# EAGLE design expansion_module_dual_rotary_encoder (EAGLE 9.6.2)
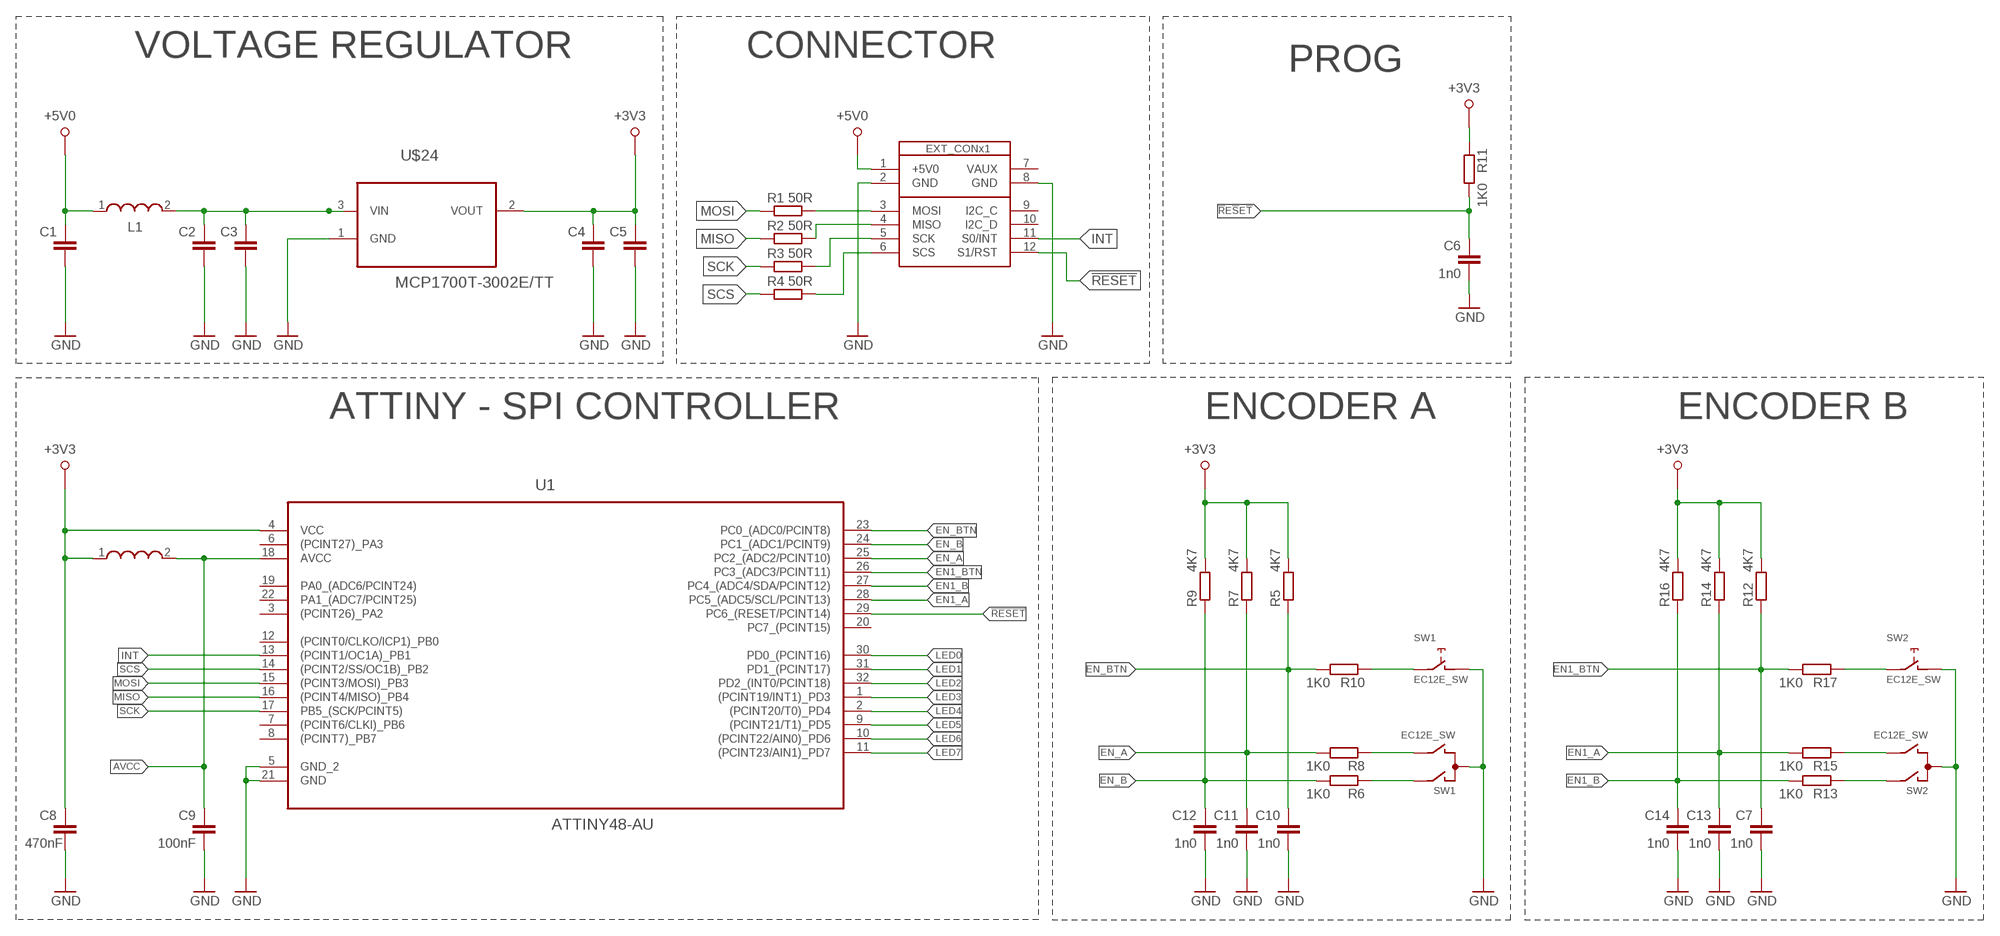
[diagram p0: schematic, sheet 1]

## Parts
C1  C-EUC0805  [C0805]
C2  C-EUC0805  [C0805]
C3  C-EUC0805  [C0805]
C4  C-EUC0805  [C0805]
C5  C-EUC0805  [C0805]
C6  1n0  C-EUC0805  [C0805]
C7  1n0  C-EUC0805  [C0805]
C8  470nF  C-EUC0805  [C0805]
C9  100nF  C-EUC0805  [C0805]
C10  1n0  C-EUC0805  [C0805]
C11  1n0  C-EUC0805  [C0805]
C12  1n0  C-EUC0805  [C0805]
C13  1n0  C-EUC0805  [C0805]
C14  1n0  C-EUC0805  [C0805]
L1  WE-LQ_1210  [WE-LQ_M]
L2  WE-PMI_0805  [WE-PMI_0805]
R1  50R  R-EU_R0805  [R0805]
R2  50R  R-EU_R0805  [R0805]
R3  50R  R-EU_R0805  [R0805]
R4  50R  R-EU_R0805  [R0805]
R5  4K7  R-EU_R0805  [R0805]
R6  1K0  R-EU_R0805  [R0805]
R7  4K7  R-EU_R0805  [R0805]
R8  1K0  R-EU_R0805  [R0805]
R9  4K7  R-EU_R0805  [R0805]
R10  1K0  R-EU_R0805  [R0805]
R11  1K0  R-EU_R0805  [R0805]
R12  4K7  R-EU_R0805  [R0805]
R13  1K0  R-EU_R0805  [R0805]
R14  4K7  R-EU_R0805  [R0805]
R15  1K0  R-EU_R0805  [R0805]
R16  4K7  R-EU_R0805  [R0805]
R17  1K0  R-EU_R0805  [R0805]
SW1  EC12E_SW  [ALPS_EC12E_SW]
SW2  EC12E_SW  [ALPS_EC12E_SW]
U1  ATTINY48-AU  [QFP80P900X900X120-32N]
U$1  SB_EXT_CON_X1_SPI  [SB_EXT_CON_X1_FULL]
U$24  MCP1700T-3002E/TT  [SOT95P237X112-3N]

## Nets
!R!E!S!E!T: C6.2 R11.2
!RESET: U1.29(PC6_(RESET/PCINT14)) U$1.12(S1/RST)
+3V3: C4.2 C5.2 C8.2 L2.1 R5.2 R7.2 R9.2 R11.1 R12.2 R14.2 R16.2 U1.4(VCC) U$24.2(VOUT)
+5V0: C1.2 L1.1 U$1.1(+5V0)
AVCC: C9.2 L2.2 U1.18(AVCC)
EN1_A: C13.2 R14.1 R15.2 U1.28(PC5_(ADC5/SCL/PCINT13))
EN1_B: C14.2 R13.2 R16.1 U1.27(PC4_(ADC4/SDA/PCINT12))
EN1_BTN: C7.2 R12.1 R17.2 U1.26(PC3_(ADC3/PCINT11))
EN_A: C11.2 R7.1 R8.2 U1.25(PC2_(ADC2/PCINT10))
EN_B: C12.2 R6.2 R9.1 U1.24(PC1_(ADC1/PCINT9))
EN_BTN: C10.2 R5.1 R10.2 U1.23(PC0_(ADC0/PCINT8))
GND: C1.1 C2.1 C3.1 C4.1 C5.1 C6.1 C7.1 C8.1 C9.1 C10.1 C11.1 C12.1 C13.1 C14.1 SW1.C SW1.D SW2.C SW2.D U1.5(GND_2) U1.21(GND) U$1.2(GND) U$1.8(GND) U$24.1(GND)
INT: U1.13((PCINT1/OC1A)_PB1) U$1.11(S0/INT)
LED0: U1.30(PD0_(PCINT16))
LED1: U1.31(PD1_(PCINT17))
LED2: U1.32(PD2_(INT0/PCINT18))
LED3: U1.1((PCINT19/INT1)_PD3)
LED4: U1.2((PCINT20/T0)_PD4)
LED5: U1.9((PCINT21/T1)_PD5)
LED6: U1.10((PCINT22/AIN0)_PD6)
LED7: U1.11((PCINT23/AIN1)_PD7)
MISO: R2.1 U1.16((PCINT4/MISO)_PB4)
MOSI: R1.1 U1.15((PCINT3/MOSI)_PB3)
N$1: R1.2 U$1.3(MOSI)
N$2: R2.2 U$1.4(MISO)
N$3: R3.2 U$1.5(SCK)
N$4: R4.2 U$1.6(SCS)
N$5: R6.1 SW1.A
N$7: R13.1 SW2.A
N$8: C2.2 C3.2 L1.2 U$24.3(VIN)
N$9: R15.1 SW2.B
N$11: R8.1 SW1.B
N$12: R10.1 SW1.E
N$13: R17.1 SW2.E
SCK: R3.1 U1.17(PB5_(SCK/PCINT5))
SCS: R4.1 U1.14((PCINT2/SS/OC1B)_PB2)
Unconnected: SW1.GND1(G) SW1.GND2(G) SW2.GND1(G) SW2.GND2(G) U1.3((PCINT26)_PA2) U1.6((PCINT27)_PA3) U1.7((PCINT6/CLKI)_PB6) U1.8((PCINT7)_PB7) U1.12((PCINT0/CLKO/ICP1)_PB0) U1.19(PA0_(ADC6/PCINT24)) U1.20(PC7_(PCINT15)) U1.22(PA1_(ADC7/PCINT25)) U$1.7(VAUX) U$1.9(I2C_C) U$1.10(I2C_D)

## Notes on the sheet
- VOLTAGE REGULATOR | CONNECTOR
- PROG
- ATTINY - SPI CONTROLLER | ENCODER A | ENCODER B

## Library data of the parts
C1-C14 = resistor:C-EU: CAPACITOR, European symbol
L1 = EagleLibrary_Wuerth_Elektronik_eiSos_rev16a:WE-LQ: SMD Inductor Characteristics Miniature chip inductor wound on a special ferrite core Small inductances for compact circuits High Q at high frequencies Low DC-resistance Operating temperature: –40 ºC to +125 ºC Applications Low power DC/DC-converters from Linear Technology, National Semiconductor, Texas Instruments, Fairchild Semiconductor, ON Semiconductor, STMicroelectronics, Maxim, MPS, Semtech, Exar, Analogic Tech, Diodes and Cologne Chip EMI-Filtering RF-circuits <http://katalog.we-online.de/media/images/eisos/IndLQ_pf2.jpg> Details see: http://katalog.we-online.de/en/pbs/WE-LQ? Updated by Dan Xu 2014-07-08 2014 (C) Wurth Elektronik
L2 = EagleLibrary_Wuerth_Elektronik_eiSos_rev16a:WE-PMI: Power Multilayer Inductor Characteristics Compact multilayer type Suitable for applications with high currents up to 2.7 A Smallest RDC-Values starting at 40 mΩ Magnetically shielded construction: No crosstalk Operating temperature: –40 °C to +125 °C Available in four sizes and three different types (Low Profile, Low RDC & High Saturation Current) Recommended soldering profile: Reflow Applications DC/DC converters especially at high switching frequencies > 1 MHz Electronic devices with very low profile Portable devices like Smart Phones, Tablets, Notebooks and Digital Cameras <http://katalog.we-online.de/media/images/eisos/IndPMI_pf2.jpgg> Details see: http://katalog.we-online.de/en/pbs/WE-PMI? Updated by Dan Xu 2014-07-08 2014 (C) Wurth Elektronik
R1-R17 = resistor:R-EU_: RESISTOR, European symbol
SW1 SW2 = alps-EC12E2424407:EC12E_SW: ALPS rotary Encoder EC12E series with switch; MPN: EC12E2424407; OC_FARNELL: 1520813; OC_NEWARK: 74M1068
U1 = Atmel_By_element14_Batch_1-00:ATTINY48-AU: 8-bit Microcontroller; MPN: ATTINY48-AU; OC_FARNELL: 1636953; OC_NEWARK: 68T3768; PACKAGE: QFP-32; SUPPLIER: Atmel
U$1 = al_smartboard:SB_EXT_CON_X1_SPI
U$24 = Microchip_By_element14_Batch_1:MCP1700T-3002E/TT: Low Quiescent Current LDO; MPN: MCP1700T-3002E/TT; OC_FARNELL: 1331482; OC_NEWARK: 84R5176; PACKAGE: SOT23-3; SUPPLIER: Microchip

## Net classes
0 default: clearance 0.205 mm

## Board
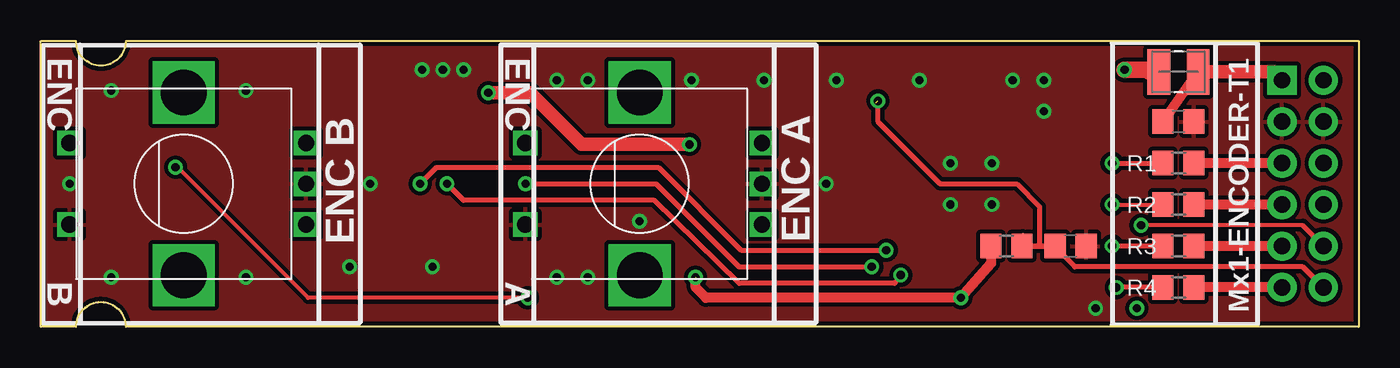
[diagram p1: board, top side]
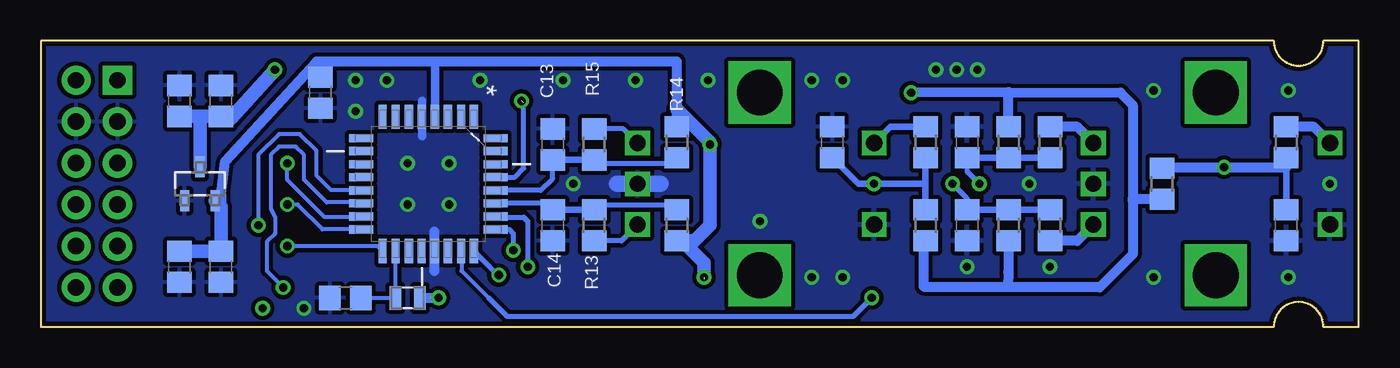
[diagram p2: board, bottom side, seen from below]

Size 80.77 x 17.53 mm. Coordinates in mm from the lower left corner, seen from the top.
Copper layers (1*16): Top 0.035mm / dielectric 1.5mm / Bottom 0.035mm
Design rules "smartboard *": minimum track width 10mil, minimum drill 15mil, track to track 8mil, track to pad 8mil, pad to pad 8mil, via to via 8mil, smd to smd 8mil, copper to edge 10mil, drill to drill 10mil, minimum pad ring 10mil, minimum via ring 8mil, stop-mask expansion 4mil, vias tented up to drill 20mil, thermal gap 10mil

### Footprints (pad centres in the part's own frame; a part is rotated, then mirrored left to right if it is on the bottom)
C0805 = smd 1.3 x 1.5: 1 -0.95,0; 2 0.95,0
WE-LQ_M = smd 1.4 x 2.8: 1 -1.2,0; 2 1.2,0
WE-PMI_0805 = smd 0.7 x 1.45: 1 -0.75,0; 2 0.75,0
R0805 = smd 1.3 x 1.5: 1 -0.95,0; 2 0.95,0
ALPS_EC12E_SW = drill 1 square: A -2.5,-7.5; B 2.5,-7.5; C 0,-7.5; D -2.5,7; E 2.5,7 | drill 2.8 square: GND1 -5.6,0; GND2 5.6,0
QFP80P900X900X120-32N = smd 1.473 x 0.508: 1 -4.115,2.794; 2 -4.115,2.007; 3 -4.115,1.194; 4 -4.115,0.406; 5 -4.115,-0.406; 6 -4.115,-1.194; 7 -4.115,-2.007; 8 -4.115,-2.794; 17 4.115,-2.794; 18 4.115,-2.007; 19 4.115,-1.194; 20 4.115,-0.406; 21 4.115,0.406; 22 4.115,1.194; 23 4.115,2.007; 24 4.115,2.794 | smd 0.508 x 1.473: 9 -2.794,-4.115; 10 -2.007,-4.115; 11 -1.194,-4.115; 12 -0.406,-4.115; 13 0.406,-4.115; 14 1.194,-4.115; 15 2.007,-4.115; 16 2.794,-4.115; 25 2.794,4.115; 26 2.007,4.115; 27 1.194,4.115; 28 0.406,4.115; 29 -0.406,4.115; 30 -1.194,4.115; 31 -2.007,4.115; 32 -2.794,4.115
SB_EXT_CON_X1_FULL = drill 1 pad 1.778 square: 1 15.24,5.08 | drill 1 pad 1.778: 2 12.7,5.08; 3 10.16,5.08; 4 7.62,5.08; 5 5.08,5.08; 6 2.54,5.08; 7 15.24,2.54; 8 12.7,2.54; 9 10.16,2.54; 10 7.62,2.54; 11 5.08,2.54; 12 2.54,2.54
SOT95P237X112-3N = smd 0.559 x 1.27: 1 -0.94,-1.041; 2 0.94,-1.041; 3 0,1.041

### Placement (x,y rotation side)
C1  69.72,12.57 180 top
C2  72.26,13.84 270 bottom
C3  69.72,13.84 270 bottom
C4  69.72,3.68 90 bottom
C5  72.26,3.68 90 bottom
C6  63.12,4.95 180 top
C7  32.26,11.3 270 bottom
C8  63.63,14.35 90 bottom
C9  62.1,1.78 0 bottom
C10  4.45,6.22 90 bottom
C11  24,11.3 270 bottom
C12  24,6.22 90 bottom
C13  49.4,11.18 270 bottom
C14  49.4,6.22 90 bottom
L1  69.72,15.62 180 top
L2  58.29,1.78 180 bottom
R1  69.72,10.03 0 top
R2  69.72,7.49 0 top
R3  69.72,4.95 0 top
R4  69.72,2.41 0 top
R5  12.07,8.76 270 bottom
R6  18.92,6.22 90 bottom
R7  21.46,11.3 90 bottom
R8  18.92,11.3 270 bottom
R9  21.46,6.22 270 bottom
R10  4.45,11.3 270 bottom
R11  59.18,4.95 0 top
R12  26.54,6.22 270 bottom
R13  46.86,6.22 90 bottom
R14  41.78,11.3 90 bottom
R15  46.86,11.18 270 bottom
R16  41.78,6.22 270 bottom
R17  26.54,11.3 270 bottom
SW1  8.76,8.76 90 top
SW2  36.7,8.76 90 top
U1  57.02,8.76 270 bottom
U$1  81.15,-0.13 90 top
U$24  71.02,8.76 0 bottom

### Tracks (layer width: path | path; a pad name or v marks a point on that pad's centre or on a via)
!R!E!S!E!T
  Top 0.305: R11.2 C6.2
!RESET  (via drill 0.5)  (1 unrouted)
  Top 0.305: U$1.12 77.34,3.68 63.37,3.68 62.1,4.95 61.09,4.95 | 61.09,4.95 60.2,4.95 60.2,5.59 | 61.09,4.95 61.21,5.08 61.21,7.37 59.82,8.76 55.12,8.76 51.31,12.57 v51.31,13.84
  Bottom 0.305: U1.29 51.71,9.17 51.18,9.7 51.18,13.72
+3V3  (via drill 0.5)  (1 unrouted)
  Top 0.61: 40.13,2.92 40.13,2.41 40.77,1.78 v56.39,1.78 58.23,3.88 R11.1
  Top 0.813: v27.43,14.35 29.97,14.35 33.15,11.18 v39.75,11.18
  Bottom 0.406: R9.2 21.46,3.43
  Bottom 0.508: U1.4 56.62,16.15
  Bottom 0.61: R9.2 21.48,3.37 21.49,2.46 | 21.49,2.46 21.49,2.44 15.88,2.41 13.84,4.44 13.84,7.75 13.78,7.81 | R5.2 13.78,7.81 | 21.46,14.38 14.61,14.35 13.84,13.59 13.84,7.88 13.78,7.81 | R7.2 21.46,14.38 | 21.46,14.38 v27.43,14.35 | L2.1 v56.39,1.78 56.26,1.78 | 56.64,16.26 41.78,16.26 41.78,13.33 R14.2 | 56.64,16.26 63.88,16.26 | 56.62,16.15 56.64,16.26 | U$24.2 70.08,7.77 69.72,8.13 | 69.72,8.13 69.47,10.16 63.88,16.26 | 69.72,8.13 69.72,6.86 | R12.2 26.67,5.15 26.67,2.54 26.67,2.46 21.49,2.46 | R16.2 41.53,5.33 | C8.2 63.88,16.26
  Bottom 0.813: U$24.2 69.72,7.37 69.72,6.86 C4.2 C5.2 | R16.2 40.7,5.27 39.75,6.22 v39.75,11.18 39.75,11.3 41.78,13.33 | 41.53,5.33 40.13,3.94 v40.13,3.05
+5V0
  Top 0.61: L1.1 C1.2
  Top 0.813: U$1.1 75.56,15.62 L1.1
AVCC
  Bottom 0.254: C9.2 L2.2 59.03,1.79 U1.18
EN1_A
  Bottom 0.305: U1.28 50.13,8.36 49.4,9.08 C13.2 | R15.2 46.86,10.03 41.78,10.03 R14.1
  Bottom 0.406: R15.2 C13.2
EN1_B
  Bottom 0.305: C14.2 49.8,7.57 U1.27 | R13.2 46.35,7.17 46.35,7.49 41.78,7.49 R16.1
  Bottom 0.406: R13.2 C14.2
EN1_BTN  (via drill 0.5)
  Top 0.305: v29.72,8.76 37.72,8.76 42.8,3.68 v50.93,3.68
  Bottom 0.305: U1.26 52.88,6.73 51.18,6.73 50.93,6.48 v50.93,3.68
  Bottom 0.406: R17.2 26.54,8.76 | 26.54,8.76 R12.1 | C7.2 30.67,8.76 v29.72,8.76 26.54,8.76
EN_A  (via drill 0.5)
  Top 0.305: v23.24,8.76 24.26,9.78 37.85,9.78 42.93,4.7 v51.82,4.7
  Bottom 0.305: U1.25 52.07,5.97 51.82,5.71 v51.82,4.7 | C11.2 24,9.53 v23.24,8.76
  Bottom 0.406: R8.2 R7.1 C11.2
EN_B  (via drill 0.5)
  Top 0.305: v52.7,3.17 52.32,2.67 42.8,2.67 37.59,7.75 25.91,7.75 v24.89,8.76
  Bottom 0.305: U1.24 53.26,3.68 v52.7,3.17 | C12.2 24,7.87 v24.89,8.76
  Bottom 0.406: R6.2 R9.1 C12.2
EN_BTN  (via drill 0.5)
  Top 0.254: v29.84,1.78 16.38,1.78 8.38,9.78 v8.25,9.78
  Bottom 0.254: U1.23 54.99,4.62 54.99,3.43 53.31,1.78
  Bottom 0.305: v29.84,1.78 30.99,0.64 52.17,0.64 53.31,1.78
  Bottom 0.406: C10.2 4.45,9.78 R10.2
  Bottom 0.61: R5.1 12,9.78 v8.25,9.78 4.45,9.78
GND  (via drill 0.5)
  Bottom 0.508: 57.4,11.68 57.4,13.84
  Bottom 0.61: 56.64,3.43 56.64,5.84
  Bottom 1.016: 42.8,8.76 45.47,8.76
  other vias: 58.29,10.03 55.75,10.03 58.29,7.49 55.75,7.49 20.19,8.76 18.92,3.68 24,3.68 44.32,15.11 48.77,15.11 53.85,15.11 59.56,15.11 61.47,15.11 36.7,6.48 23.37,15.75 24.64,15.75 25.91,15.75 64.64,1.14 61.47,13.21 48.13,8.76 39.88,15.11 33.53,15.11 33.53,3.05 31.62,3.05 31.62,15.11 1.78,8.76 4.32,3.05 12.57,3.05 12.57,14.48 4.32,14.48
  pour Bottom (isolate 0.254): 81.41,17.65 30.1,17.78 29.97,-0.13 81.41,-0.13
  pour Top (isolate 0.254): 80.9,17.65 64.39,17.78 64.39,-0.25 80.9,-0.13
  pour Bottom (isolate 0.254): -1.27,17.65 31.12,17.65 31.12,-0.13 -1.27,-0.13
  pour Top (isolate 0.254): -1.02,17.65 64.39,17.65 64.39,-0.13 -1.02,-0.13
INT  (via drill 0.5)
  Top 0.254: 77.34,6.22 v67.44,6.22
  Top 0.305: U$1.11 77.34,6.22
  Bottom 0.254: U1.13 61.16,8.38 62.99,8.38 63.88,9.27 63.88,10.79 64.9,11.81 66.17,11.81 67.44,10.54 v67.44,6.22
MISO  (via drill 0.5)
  Top 0.254: v65.66,7.49 R2.1
  Bottom 0.254: U1.16 63.5,5.97 65.02,7.49 v65.66,7.49
MOSI  (via drill 0.5)
  Top 0.305: v65.66,10.03 R1.1
  Bottom 0.254: U1.15 61.16,6.73 63.37,6.73 65.66,9.02 v65.66,10.03
N$1
  Top 0.61: U$1.3 R1.2
N$2
  Top 0.61: U$1.4 R2.2
N$3
  Top 0.61: U$1.5 R3.2
N$4
  Top 0.61: U$1.6 R4.2
N$5
  Bottom 0.61: SW1.A 17.25,5.27 R6.1
N$6  (via drill 0.5)
  other vias: 67.18,1.14
N$7
  Bottom 0.305: SW2.A 45.19,5.27 R13.1
N$8  (via drill 0.5)
  Top 1.016: v66.42,15.75 67.82,15.75 67.94,15.62 L1.2
  Bottom 0.813: v66.42,15.75 69.15,12.77 C3.2 70.99,12.89 | C2.2 70.99,12.89 | U$24.3 70.99,9.8 70.99,12.89
N$9
  Bottom 0.305: SW2.B 45.07,12.13 R15.1
N$11
  Bottom 0.61: SW1.B 17.25,12.25 R8.1
N$12
  Bottom 0.61: SW1.E 2.75,12.25 R10.1
N$13
  Bottom 0.406: SW2.E 28.71,12.25 R17.1
SCK  (via drill 0.5)
  Top 0.305: R3.1 v65.66,4.95
  Bottom 0.254: U1.17 60.12,4.95 v65.66,4.95
SCS  (via drill 0.5)
  Top 0.305: R4.1 v65.91,2.41
  Bottom 0.254: U1.14 61.19,7.62 63.25,7.62 64.64,9.02 64.64,10.54 65.15,11.05 66.17,11.05 66.67,10.54 66.67,7.24 66.42,6.73 66.42,5.71 66.93,5.21 66.93,3.43 v65.91,2.41

### Text on the board
tPlace: ENC | ENC | ENC A | ENC B | B | A
tNames: Mx1-ENCODER-T1